# EAGLE design Wireless Switch (EAGLE 7.2.0)
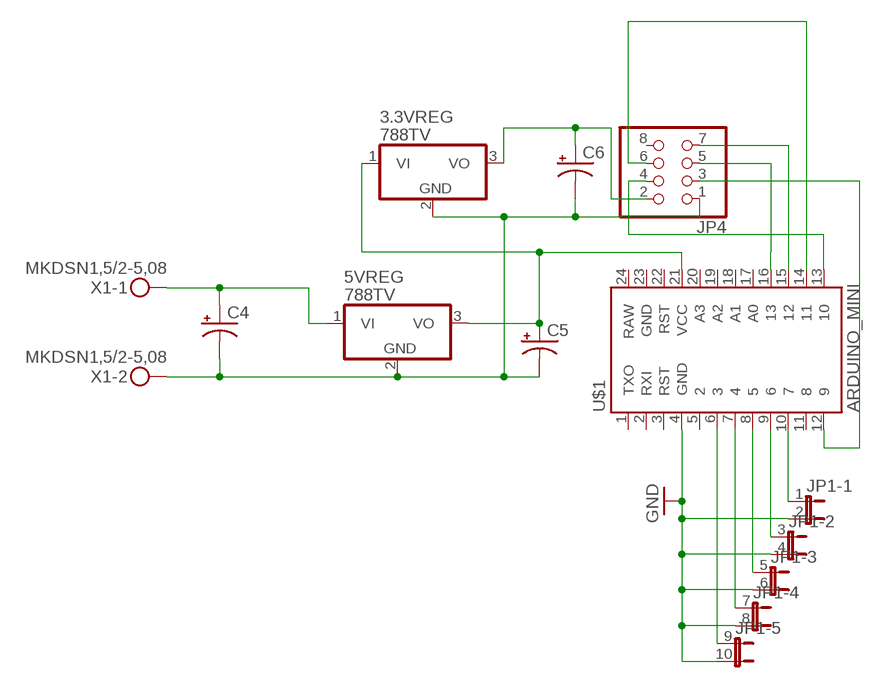
[diagram p0: schematic, sheet 1]

## Parts
3.3VREG  788TV  [TO220V]
5VREG  788TV  [TO220V]
C4  CPOL-USE3.5-8  [E3,5-8]
C5  CPOL-USE3.5-8  [E3,5-8]
C6  CPOL-USE2.5-6  [E2,5-6]
JP1  JP5QE  [JP5Q]
JP4  PINHD-2X4  [2X04]
U$1  ARDUINO_MINI  [ARDUINO_MINI]
X1  MKDSN1,5/2-5,08  [MKDSN1,5/2-5,08]

## Nets
GND: JP1.2 JP1.4 JP1.6 JP1.8 JP1.10 U$1.4(GND)
N$1: 5VREG.1(VI) C4.+ X1.1
N$2: 3.3VREG.2(GND) 5VREG.2(GND) C4.- C5.- C6.- JP4.1 X1.2
N$3: 3.3VREG.1(VI) 5VREG.3(VO) C5.+ U$1.21(VCC)
N$5: JP1.9 U$1.6
N$6: JP1.7 U$1.7
N$7: JP1.5 U$1.8
N$8: JP1.3 U$1.9
N$9: JP1.1 U$1.10
N$10: 3.3VREG.3(VO) C6.+ JP4.2
N$12: JP4.6 U$1.14
N$13: JP4.4 U$1.13
N$14: JP4.7 U$1.15
N$15: JP4.5 U$1.16
N$16: JP4.3 U$1.12
Unconnected: JP4.8 U$1.1(TXO) U$1.2(RXI) U$1.3(RST) U$1.5 U$1.11 U$1.17(A0) U$1.18(A1) U$1.19(A2) U$1.20(A3) U$1.22(RST) U$1.23(GND) U$1.24(RAW)

## Library data of the parts
3.3VREG 5VREG = linear:78*: Positive VOLTAGE REGULATOR Source: http://cache.national.com/ds/LM/LM78L05.pdf http://www.fairchildsemi.com/ds/LM/LM7805.pdf
C4-C6 = adafruit:CPOL-US: POLARIZED CAPACITOR, American symbol
JP1 = jumper:JP5QE: JUMPER
JP4 = adafruit:PINHD-2X4: PIN HEADER
U$1 = SparkFun-Boards:ARDUINO_MINI: Arduino Pro Mini footprint
X1 = con-phoenix-508:MKDSN1,5/2-5,08: MKDSN 1,5/ 2-5,08 Printklemme Nennstrom: 13,5 A Nennspannung: 250 V Rastermaß: 5,08 mm Polzahl: 2 Anschlussart: Schraubanschluss Montage: Löten Anschlussrichtung Leiter/Platine: 0 ° Artikelnummer: 1729128 Source: http://eshop.phoenixcontact.com .. 1729128.pdf

## Board
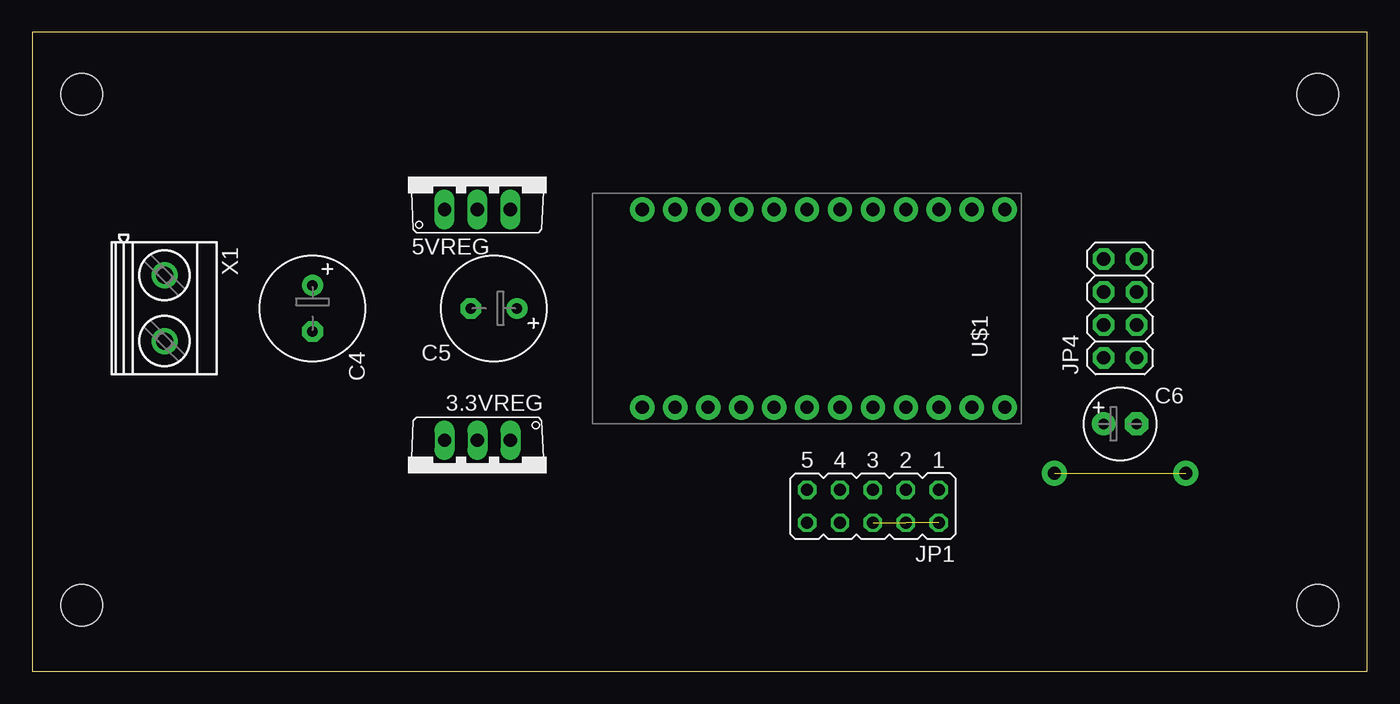
[diagram p1: board, top side]
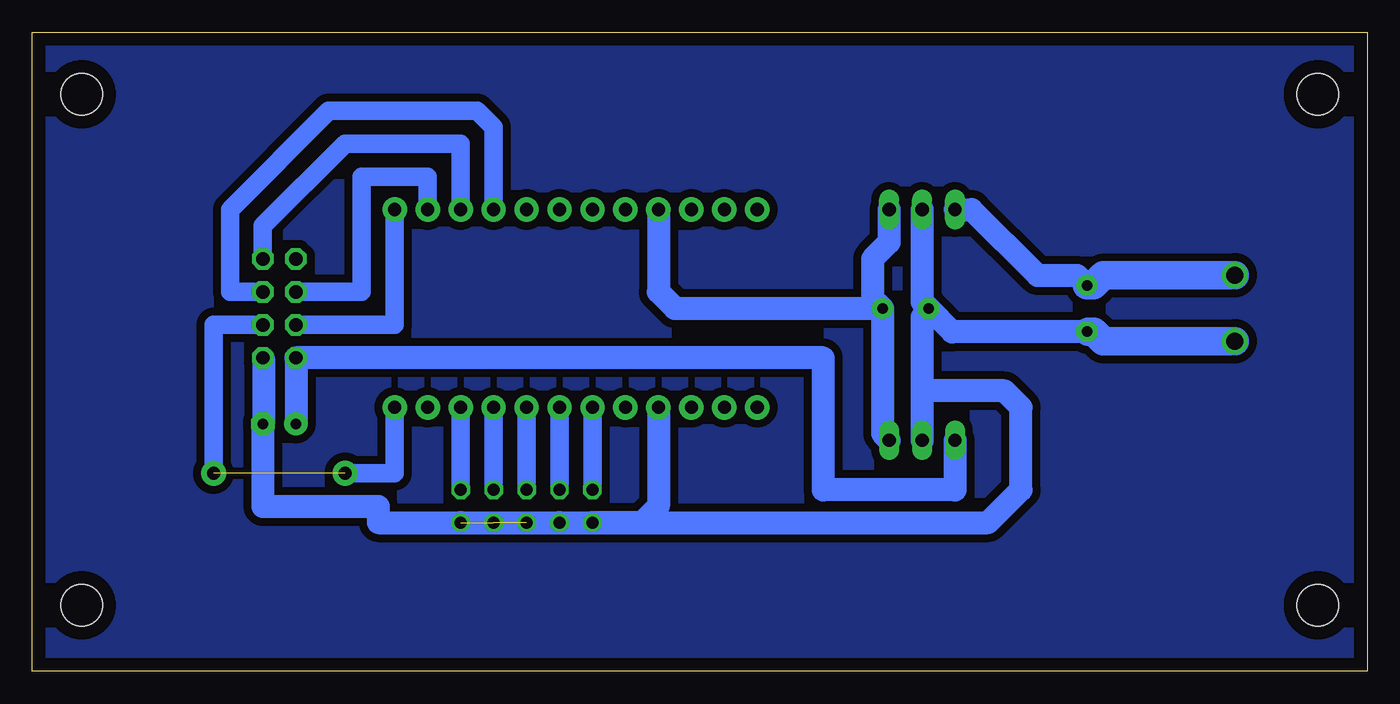
[diagram p2: board, bottom side, seen from below]

Size 102.85 x 49.2 mm. Coordinates in mm from the lower left corner, seen from the top.
Outline: 0,0 102.85,0 102.85,49.2 0,49.2 0,0
Copper layers (1*16): Top 0.035mm / dielectric 1.5mm / Bottom 0.035mm
Design rules "default": minimum track width 10mil, minimum drill 24mil, track to track 8mil, track to pad 8mil, pad to pad 8mil, via to via 8mil, smd to smd 8mil, copper to edge 40mil, drill to drill 8mil, minimum pad ring 10mil, minimum via ring 8mil, stop-mask expansion 4mil, vias tented up to drill 0mil, thermal gap 10mil
Holes 3.2 mm at 3.81,5.08 99.06,5.08 99.06,44.45 3.81,44.45

### Footprints (pad centres in the part's own frame; a part is rotated, then mirrored left to right if it is on the bottom)
TO220V = drill 1.016 long: 1 -2.54,-2.54; 2 0,-2.54; 3 2.54,-2.54
E3,5-8 = drill 0.813 pad 1.6: + -1.778,0 | drill 0.813 pad 1.6 octagon: - 1.778,0
E2,5-6 = drill 0.813 pad 1.778: + -1.27,0 | drill 0.813 pad 1.778 octagon: - 1.27,0
JP5Q = drill 0.914 octagon: 1 -5.08,-1.27; 2 -5.08,1.27; 3 -2.54,-1.27; 4 -2.54,1.27; 5 0,-1.27; 6 0,1.27; 7 2.54,-1.27; 8 2.54,1.27; 9 5.08,-1.27; 10 5.08,1.27
2X04 = drill 1.016 pad 1.676 octagon: 1 -3.81,-1.27; 2 -3.81,1.27; 3 -1.27,-1.27; 4 -1.27,1.27; 5 1.27,-1.27; 6 1.27,1.27; 7 3.81,-1.27; 8 3.81,1.27
ARDUINO_MINI = drill 1.016 pad 1.88: 1 -7.62,12.7; 2 -7.62,10.16; 3 -7.62,7.62; 4 -7.62,5.08; 5 -7.62,2.54; 6 -7.62,0; 7 -7.62,-2.54; 8 -7.62,-5.08; 9 -7.62,-7.62; 10 -7.62,-10.16; 11 -7.62,-12.7; 12 -7.62,-15.24; 13 7.62,-15.24; 14 7.62,-12.7; 15 7.62,-10.16; 16 7.62,-7.62; 17 7.62,-5.08; 18 7.62,-2.54; 19 7.62,0; 20 7.62,2.54; 21 7.62,5.08; 22 7.62,7.62; 23 7.62,10.16; 24 7.62,12.7
MKDSN1,5/2-5,08 = drill 1.3 pad 2: 1 -2.561,0.025; 2 2.519,0.025

### Placement (x,y rotation side)
3.3VREG  34.29,15.24 180 top
5VREG  34.29,38.1 0 top
C4  21.59,27.94 270 top
C5  35.56,27.94 180 top
C6  83.82,19.05 0 top
JP1  64.77,12.7 180 top
JP4  83.82,27.94 90 top
U$1  59.69,27.94 90 top
X1  10.16,27.94 270 top

### Tracks (layer width: path | path; a pad name or v marks a point on that pad's centre or on a via)
GND  (2 unrouted)
  Bottom 1.778: U$1.4 54.61,12.7 55.88,11.43 JP1.10 JP1.8 JP1.2
N$1
  Bottom 1.778: 5VREG.1 30.48,35.56 25.4,30.48 22.35,30.48 C4.+
  Bottom 2.184: C4.+ 21.08,29.72 20.32,30.48 10.21,30.48 X1.1
N$2
  Bottom 0.254: 10.97,26.14 10.29,25.45 X1.2 | 21.49,26.14 C4.- 21.72,26.14 | 85.04,24.08 JP4.1 | 85.04,19.05 C6.- | 34.29,27.28 33.83,27.74 C5.-
  Bottom 1.778: 21.72,26.14 31.98,26.14 C5.- 34.29,28.45 5VREG.2 | 34.29,27.28 34.29,21.59 | 34.29,21.59 3.3VREG.2 | 34.29,21.59 27.94,21.59 26.67,20.32 26.67,13.97 29.21,11.43 76.2,11.43 76.2,12.7 85.09,12.7 C6.- 85.04,19.1 85.04,24.08
  Bottom 2.184: 21.49,26.14 21.06,26.14 20.32,25.4 10.21,25.4 X1.2
N$3
  Bottom 1.778: 5VREG.3 36.83,33.02 38.1,31.75 38.1,28.7 37.72,28.32 | 37.72,28.32 C5.+ 37.34,18.29 3.3VREG.1 | U$1.21 54.61,29.21 53.34,27.94 38.1,27.94 37.72,28.32
N$4
  pour Bottom (isolate 0.61): 0,49.53 102.87,49.53 102.87,0 0,0
N$5
  Bottom 1.422: U$1.6 JP1.9
N$6
  Bottom 0.254: 62.41,14.02 JP1.7
  Bottom 1.422: U$1.7 JP1.7
N$7
  Bottom 1.422: U$1.8 JP1.5
N$8
  Bottom 1.422: U$1.9 JP1.3
N$9
  Bottom 1.422: U$1.10 JP1.1
N$10
  Bottom 0.254: 82.53,24.08 JP4.2
  Bottom 1.778: 3.3VREG.3 31.75,13.97 41.91,13.97 41.91,24.13 JP4.2 | 82.53,24.08 82.53,19.07 C6.+
N$11  (via drill 1 pad 1.93)
  other vias: 78.74,15.24
N$12
  Bottom 1.422: U$1.14 72.39,38.1 77.47,38.1 77.47,29.21 JP4.6
N$13
  Bottom 1.422: U$1.13 74.93,26.67 JP4.4
N$14
  Bottom 1.422: U$1.15 69.85,40.64 78.74,40.64 85.09,34.29 JP4.7
N$15
  Bottom 1.422: U$1.16 67.31,41.91 68.58,43.18 80.01,43.18 87.63,35.56 87.63,29.21 JP4.5
N$16  (1 unrouted)
  Bottom 1.422: U$1.12 74.93,15.24 78.74,15.24 | JP4.3 88.9,26.67 88.9,15.24
N$17  (via drill 1 pad 1.93)
  other vias: 88.9,15.24